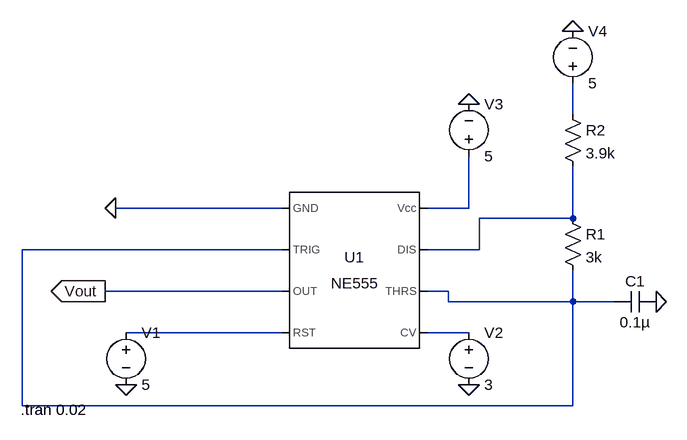
[diagram p0: schematic 9.VOLTAGE TO FREQ CONVERTER.asc]
9.VOLTAGE TO FREQ CONVERTER.asc, the LTspice schematic file:
Version 4
SHEET 1 1016 680
WIRE 624 32 624 -16
WIRE 176 176 -80 176
WIRE 464 176 464 96
WIRE 464 176 400 176
WIRE 624 192 624 112
WIRE 624 192 480 192
WIRE 176 240 -224 240
WIRE 480 240 480 192
WIRE 480 240 400 240
WIRE 176 304 -96 304
WIRE 432 304 400 304
WIRE 432 320 432 304
WIRE 624 320 624 272
WIRE 624 320 432 320
WIRE 688 320 624 320
WIRE 176 368 -64 368
WIRE 464 368 400 368
WIRE -224 480 -224 240
WIRE 624 480 624 320
WIRE 624 480 -224 480
FLAG -96 304 Vout
IOPIN -96 304 Out
FLAG 752 320 0
FLAG -80 176 0
FLAG -64 448 0
FLAG 464 448 0
FLAG 464 16 0
FLAG 624 -96 0
SYMBOL Misc\\NE555 288 272 R0
SYMATTR InstName U1
SYMBOL voltage -64 352 R0
WINDOW 123 0 0 Left 0
WINDOW 39 0 0 Left 0
SYMATTR InstName V1
SYMATTR Value 5
SYMBOL voltage 464 352 R0
WINDOW 123 0 0 Left 0
WINDOW 39 0 0 Left 0
SYMATTR InstName V2
SYMATTR Value 3
SYMBOL voltage 464 112 M180
WINDOW 0 24 96 Left 2
WINDOW 3 24 16 Left 2
WINDOW 123 0 0 Left 0
WINDOW 39 0 0 Left 0
SYMATTR InstName V3
SYMATTR Value 5
SYMBOL voltage 624 0 M180
WINDOW 0 24 96 Left 2
WINDOW 3 24 16 Left 2
WINDOW 123 0 0 Left 0
WINDOW 39 0 0 Left 0
SYMATTR InstName V4
SYMATTR Value 5
SYMBOL cap 752 304 R90
WINDOW 0 0 32 VBottom 2
WINDOW 3 32 32 VTop 2
SYMATTR InstName C1
SYMATTR Value 0.1µ
SYMBOL res 608 176 R0
SYMATTR InstName R1
SYMATTR Value 3k
SYMBOL res 608 16 R0
SYMATTR InstName R2
SYMATTR Value 3.9k
TEXT -226 486 Left 2 !.tran 0.02

The netlist it stands for:
* 9.VOLTAGE TO FREQ CONVERTER.asc
XU1 0 N004 Vout N005 N006 N004 N003 N002 NE555  ; pins GND TRIG OUT RST CV THRS DIS Vcc
V1 N005 0 5
V2 N006 0 3
V3 N002 0 5
V4 N001 0 5
C1 0 N004 0.1µ
R1 N003 N004 3k
R2 N001 N003 3.9k
.tran 0.02
.lib NE555.sub
.backanno
.end